# EAGLE design rrled (EAGLE 6.4)
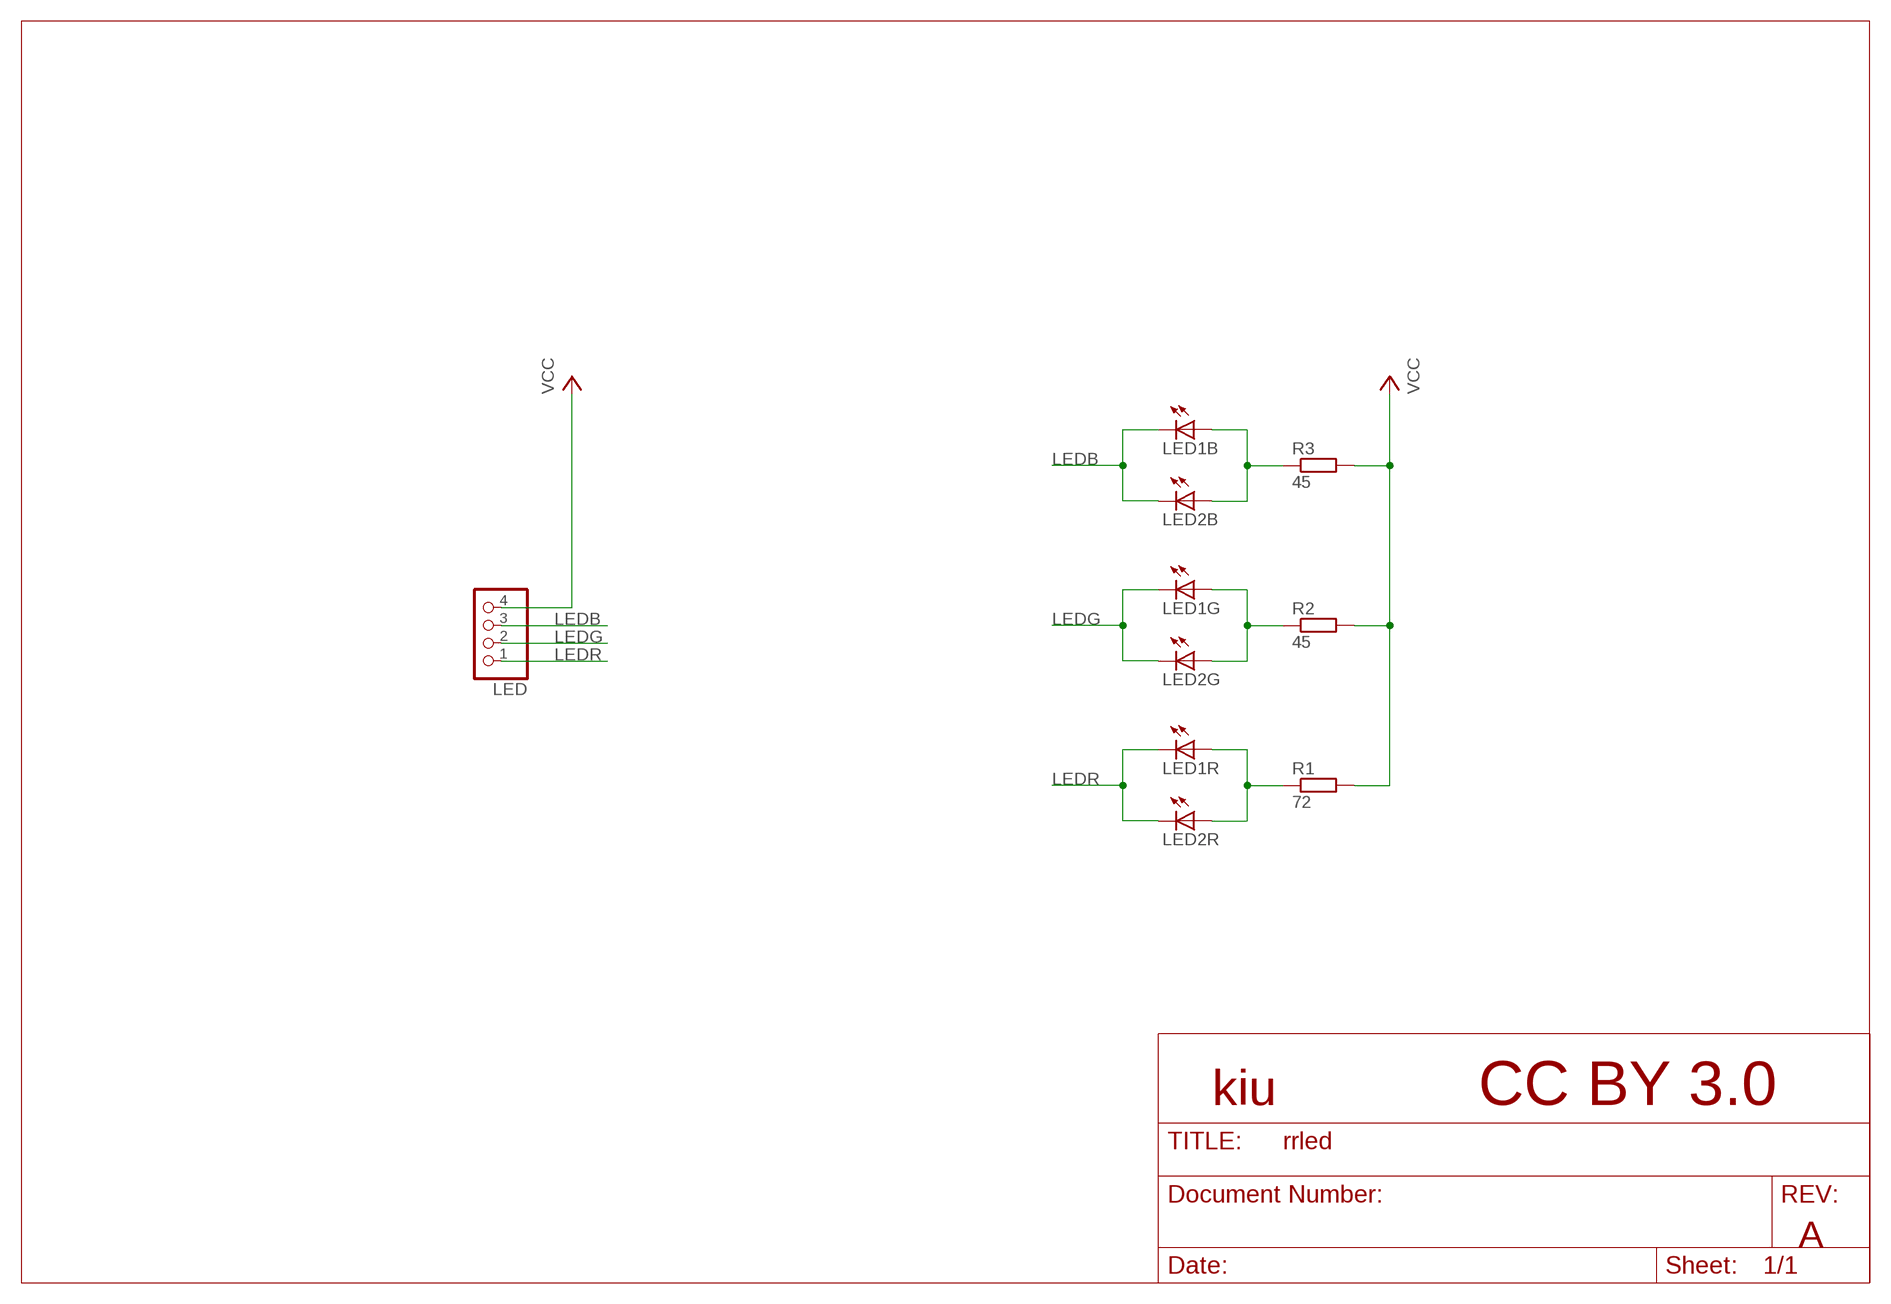
[diagram p0: schematic, sheet 1]

## Parts
LED  PINHD-1X4  [1X04]
LED1  MULTILED_LRTB_G6TG  [P-LCC-6_TOPLED]
LED2  MULTILED_LRTB_G6TG  [P-LCC-6_TOPLED]
R1  72  R-EU_R0603  [R0603]
R2  45  R-EU_R0603  [R0603]
R3  45  R-EU_R0603  [R0603]

## Nets
LEDB: LED1.C3(B:C) LED2.C3(B:C) LED.3
LEDG: LED1.C2(G:C) LED2.C2(G:C) LED.2
LEDR: LED1.C1(R:C) LED2.C1(R:C) LED.1
N$5: LED1.A2(G:A) LED2.A2(G:A) R2.1
N$6: LED1.A3(B:A) LED2.A3(B:A) R3.1
N$7: LED1.A1(R:A) LED2.A1(R:A) R1.1
VCC: LED.4 R1.2 R2.2 R3.2

## Notes on the sheet
- kiu | CC BY 3.0
- A

## Library data of the parts
LED = pinhead:PINHD-1X4: PIN HEADER
LED1 LED2 = led:MULTILED_LRTB_G6TG: 6-lead MULTILED® Enhanced optical Power LED (ThinFilm® / ThinGaN®) Source. OSRAM - LRTB_G6TG.pdf
R1-R3 = rcl:R-EU_: RESISTOR, European symbol

## Board
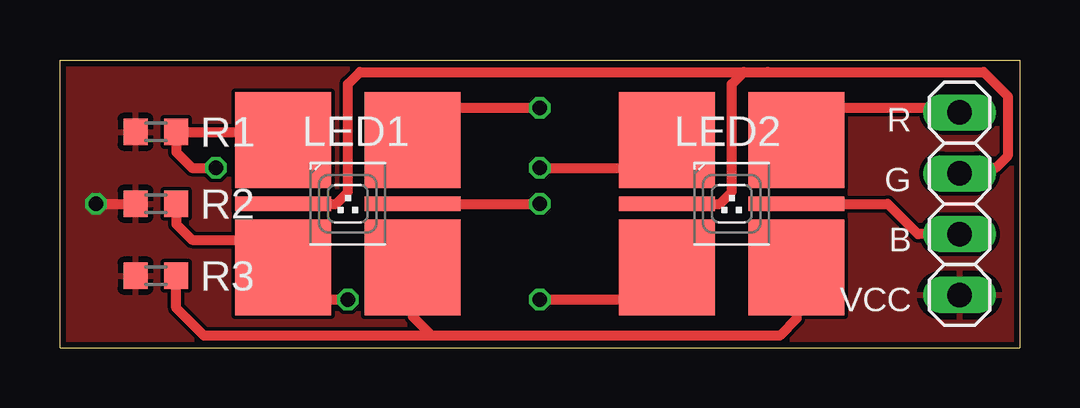
[diagram p1: board, top side]
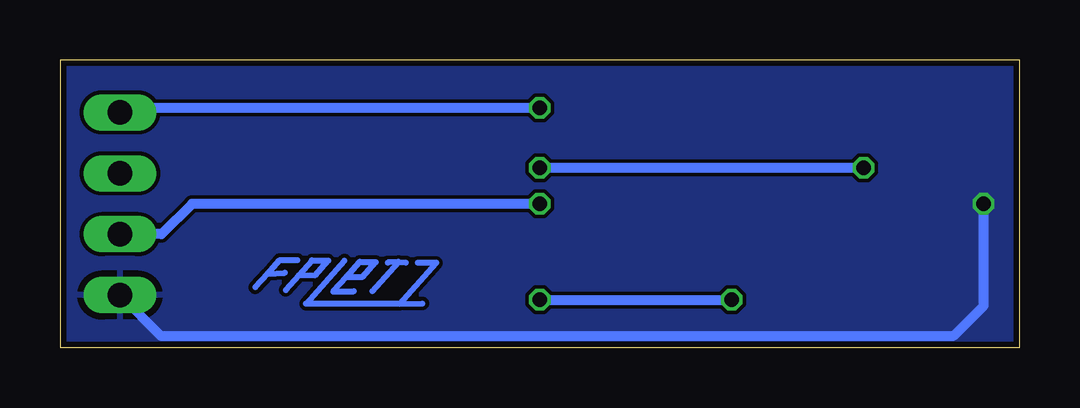
[diagram p2: board, bottom side, seen from below]

Size 40 x 12 mm. Coordinates in mm from the lower left corner, seen from the top.
Outline: 0,0 0,12 40,12 40,0 0,0
Copper layers (1*2*15*16): Top 0.035mm / dielectric 0.2mm / layer 2 0.0175mm / dielectric 1.1mm / layer 15 0.0175mm / dielectric 0.2mm / Bottom 0.035mm
Design rules "SeeedStudio_DRU_no_angle_20130527": minimum track width 6mil, minimum drill 12mil, track to track 6mil, track to pad 6mil, pad to pad 6mil, via to via 6mil, smd to smd 0mil, copper to edge 10mil, drill to drill 10mil, minimum pad ring 6mil, minimum via ring 6mil, stop-mask expansion 2mil, vias tented up to drill 25mil, thermal gap 10mil

### Footprints (pad centres in the part's own frame; a part is rotated, then mirrored left to right if it is on the bottom)
1X04 = drill 1.016 long: 1 -3.81,0; 2 -1.27,0; 3 1.27,0; 4 3.81,0
P-LCC-6_TOPLED = smd 4 x 4: A1 -2.65,-2.7; A2 2.65,-2.7; A3 2.65,2.7; C1 -2.65,2.7 | smd 0.6 x 4: C2 0,-2.7; C3 0,2.7
R0603 = smd 1 x 1.1: 1 -0.85,0; 2 0.85,0

### Placement (x,y rotation side)
LED  37.5,6 270 top
LED1  12,6 270 top
LED2  28,6 270 top
R1  4,9 180 top
R2  4,6 180 top
R3  4,3 180 top

### Tracks (layer width: path | path; a pad name or v marks a point on that pad's centre or on a via)
LEDB  (via drill 0.6)
  Top 0.406: LED.3 35.77,4.73 34.5,6 LED2.C3 | LED1.C3 v20,6
  Bottom 0.406: LED.3 35.77,4.73 34.5,6 v20,6
LEDG
  Top 0.406: LED2.C2 27.5,6 28,6.5 28,11 28.5,11.5 | 28.5,11.5 29.5,11.5 38.5,11.5 39.5,10.5 39.5,8 39,7.5 37.73,7.5 LED.2 | LED1.C2 11.5,6 12,6.5 12,11 12.5,11.5 28.5,11.5
LEDR  (via drill 0.6)
  Top 0.406: v20,10 16.05,10 LED1.C1 | 31.86,9.81 LED2.C1 32.05,10 37.31,10 LED.1
  Bottom 0.406: v20,10 37.31,10 LED.1
N$5  (via drill 0.6)
  Top 0.406: LED2.A2 24.45,2 v20,2 | v12,2 10.65,2 LED1.A2 8.15,4.5 5.5,4.5 4.85,5.15 R2.1
  Bottom 0.406: v20,2 v12,2
N$6
  Top 0.406: R3.1 4.85,1.65 6,0.5 15.5,0.5 | LED2.A3 30.7,1.2 30,0.5 15.5,0.5 | LED1.A3 14.7,1.3 15.5,0.5
N$7  (via drill 0.6)
  Top 0.406: LED1.A1 8.95,9 R1.1 4.85,8.15 5.5,7.5 v6.5,7.5 | v20,7.5 24.15,7.5 LED2.A1
  Bottom 0.406: v6.5,7.5 v20,7.5
N$28
  Bottom 0.254: 30.04,3.02 29.49,3.64 28.82,3.63 29.37,3.02 30.04,3.02 | 30.59,2.41 30.04,3.02
N$29
  Bottom 0.254: 28.14,3.63 29.75,1.82 25.83,1.83 | 25.08,3.53 24.31,3.53 25.83,1.83 | 25.83,1.83 24.89,1.83
N$30
  Bottom 0.254: 27.75,2.35 28.61,2.34 28.06,2.96 | 28.06,2.96 27.51,3.57 26.83,3.57 27.38,2.95 28.06,2.96
N$31
  Bottom 0.254: 30.1,3.65 30.84,3.65 31.35,3.08 | 31.35,3.08 31.86,2.51 | 31.35,3.08 30.63,3.12
N$32
  Bottom 0.254: 25.89,3.58 26.34,3.55 | 26.99,2.34 25.89,3.58 | 25.89,3.58 25.57,3.55
VCC  (via drill 0.6)
  Top 0.406: v1.5,6 R2.2
  Bottom 0.406: LED.4 35.81,0.5 2.75,0.5 1.5,1.75 v1.5,6
  pour Bottom: -0.5,12.5 40.5,12.5 40.5,-0.5 -0.5,-0.5
  pour Top: -0.5,12.5 40.5,12.5 40.5,-0.5 -0.5,-0.5

### Text on the board
tNames: R | G | B | VCC
tDocu: RRLED REV A | kiu